# EAGLE design Dendro (EAGLE 9.6.2)
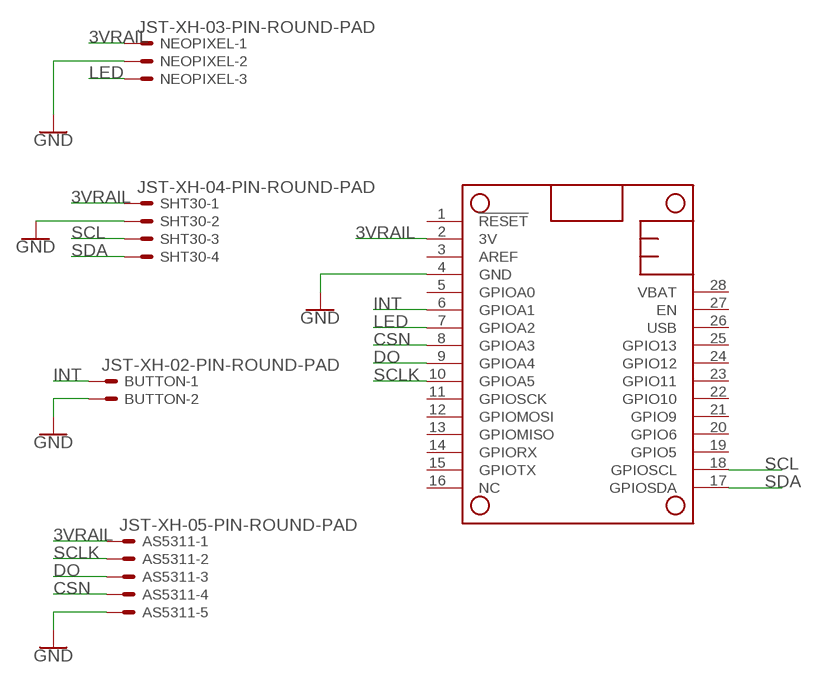
[diagram p0: schematic, sheet 1]

## Parts
AS5311  JST-XH-05-PIN-ROUND-PAD  [JST-XH-05-PACKAGE-ROUND-PAD]
BUTTON  JST-XH-02-PIN-ROUND-PAD  [JST-XH-02-PACKAGE-ROUND-PAD]
MS1  FEATHERWING  [FEATHERWING]
NEOPIXEL  JST-XH-03-PIN-ROUND-PAD  [JST-XH-03-PACKAGE-ROUND-PAD]
SHT30  JST-XH-04-PIN-ROUND-PAD  [JST-XH-04-PACKAGE-ROUND-PAD]

## Nets
3VRAIL: AS5311.1 MS1.2(3V) NEOPIXEL.1 SHT30.1
CSN: AS5311.4 MS1.8(GPIOA3)
DO: AS5311.3 MS1.9(GPIOA4)
GND: AS5311.5 BUTTON.2 MS1.4(GND) NEOPIXEL.2 SHT30.2
INT: BUTTON.1 MS1.6(GPIOA1)
LED: MS1.7(GPIOA2) NEOPIXEL.3
SCL: MS1.18(GPIOSCL) SHT30.3
SCLK: AS5311.2 MS1.10(GPIOA5)
SDA: MS1.17(GPIOSDA) SHT30.4
Unconnected: MS1.1(!RESET) MS1.3(AREF) MS1.5(GPIOA0) MS1.11(GPIOSCK) MS1.12(GPIOMOSI) MS1.13(GPIOMISO) MS1.14(GPIORX) MS1.15(GPIOTX) MS1.16(NC) MS1.19(GPIO5) MS1.20(GPIO6) MS1.21(GPIO9) MS1.22(GPIO10) MS1.23(GPIO11) MS1.24(GPIO12) MS1.25(GPIO13) MS1.26(USB) MS1.27(EN) MS1.28(VBAT)

## Library data of the parts
AS5311 = Rembrandt Electronics - JST XH Connectors v1-0:JST-XH-05-PIN: JST XH Connector 2 Pin Wire to board connector. Pitch: 2,54 mm, (0.100") Number of pins: 5 Created by Rembrandt Electronics www.rembrandtelectronics.com
BUTTON = Rembrandt Electronics - JST XH Connectors v1-0:JST-XH-02-PIN: JST XH Connector 2 Pin Wire to board connector. Pitch: 2,54 mm, (0.100") Number of pins: 2 Created by Rembrandt Electronics www.rembrandtelectronics.com
MS1 = modifiedAdafruit:FEATHERWING
NEOPIXEL = Rembrandt Electronics - JST XH Connectors v1-0:JST-XH-03-PIN: JST XH Connector 2 Pin Wire to board connector. Pitch: 2,54 mm, (0.100") Number of pins: 3 Created by Rembrandt Electronics www.rembrandtelectronics.com
SHT30 = Rembrandt Electronics - JST XH Connectors v1-0:JST-XH-04-PIN: JST XH Connector 2 Pin Wire to board connector. Pitch: 2,54 mm, (0.100") Number of pins: 4 Created by Rembrandt Electronics www.rembrandtelectronics.com

## Board
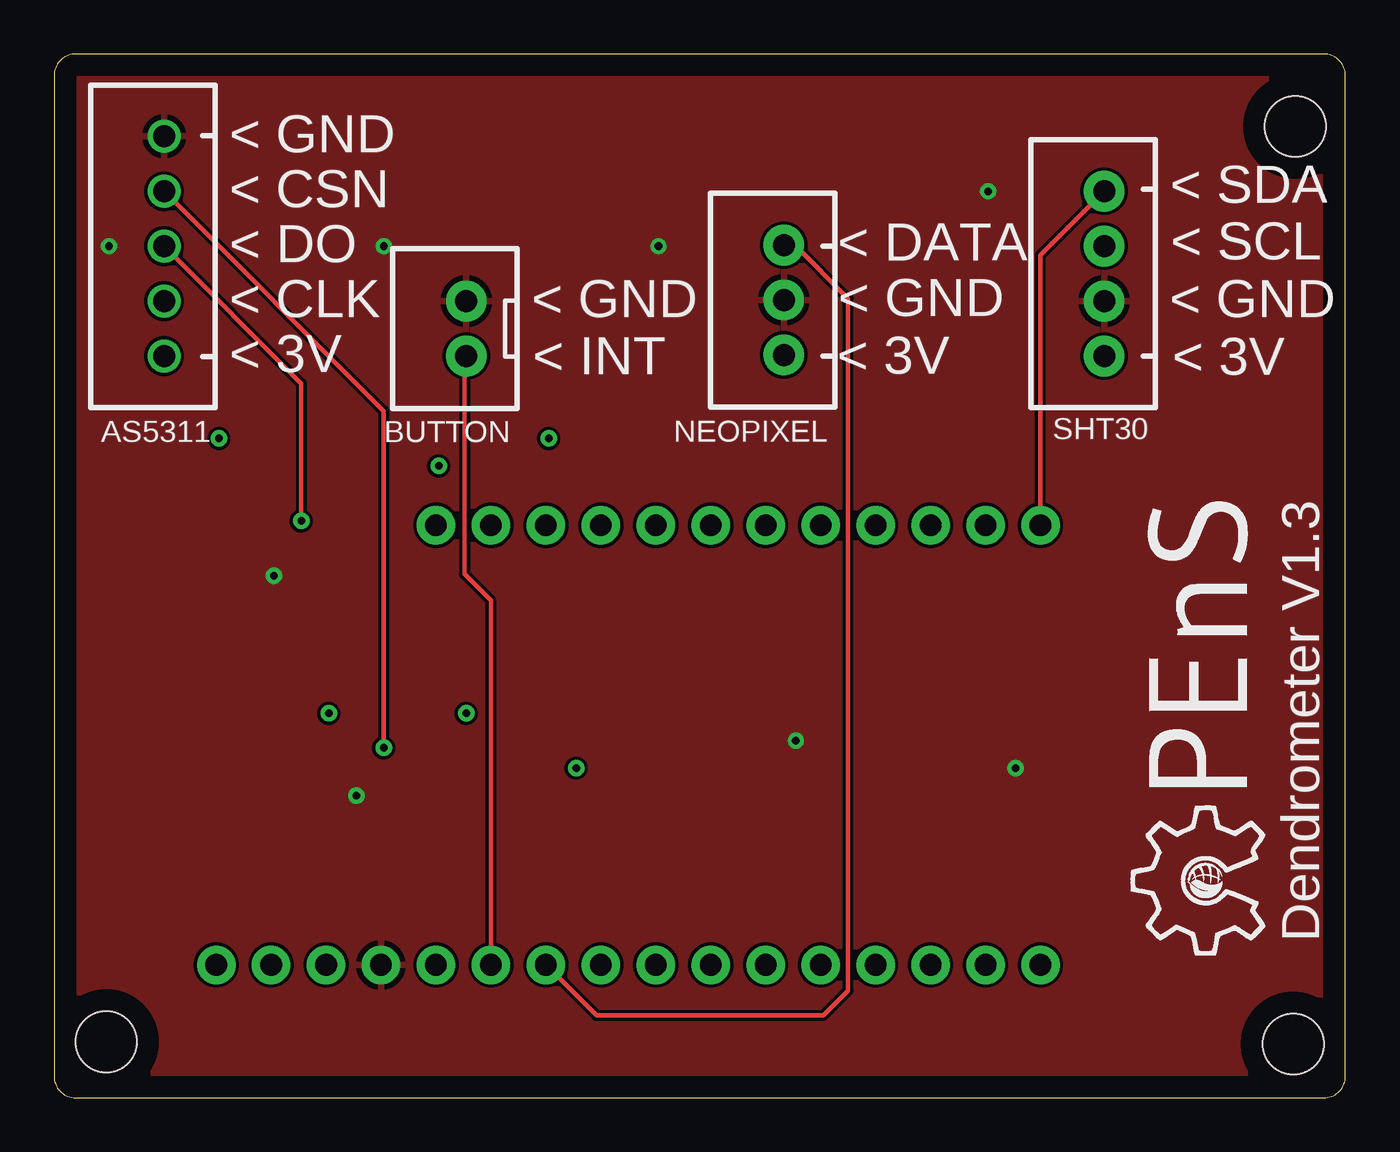
[diagram p1: board, top side]
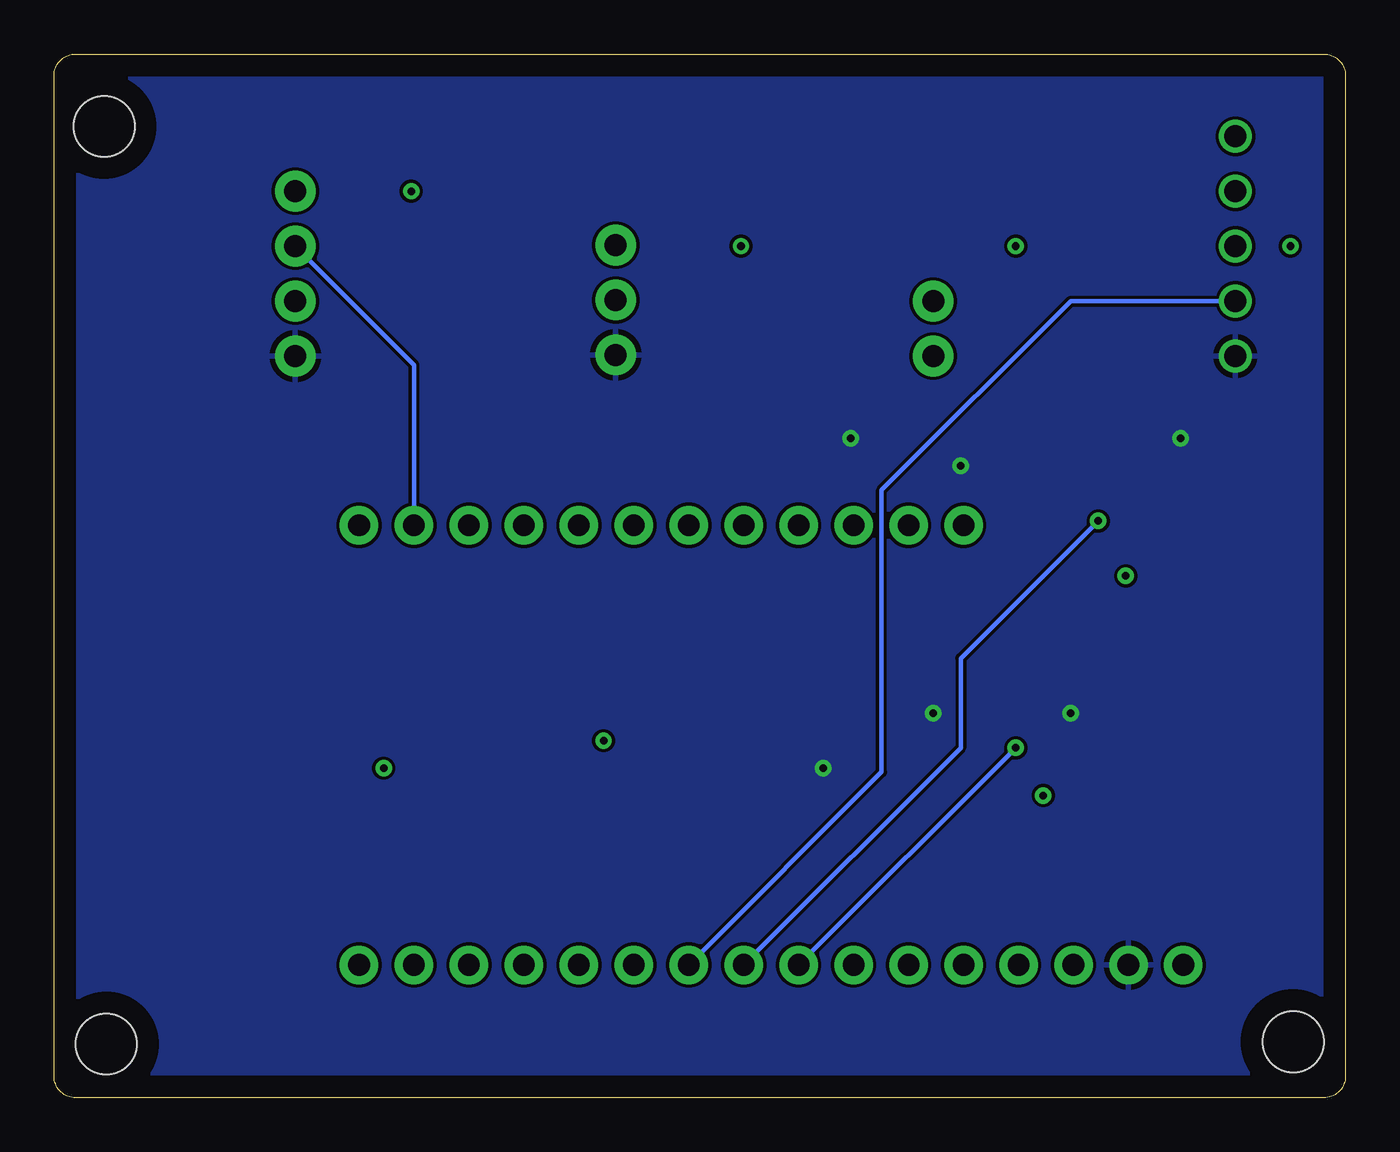
[diagram p2: board, bottom side, seen from below]

Size 59.69 x 48.25 mm. Coordinates in mm from the lower left corner, seen from the top.
Outline: 0,47.25 0,1 arc90 1,0 58.69,0 arc90 59.69,1 59.69,47.25 arc90 58.69,48.25 1,48.25 arc90 0,47.25
Copper layers (1*16): Top 0.035mm / dielectric 1.5mm / Bottom 0.035mm
Design rules "default": minimum track width 6mil, minimum drill 0.35mm, track to track 6mil, track to pad 6mil, pad to pad 6mil, via to via 6mil, smd to smd 6mil, copper to edge 40mil, drill to drill 6mil, minimum pad ring 10mil, minimum via ring 8mil, stop-mask expansion 4mil, vias tented up to drill 0mil, thermal gap 10mil
Holes 2.8 mm at 2.41,2.59 57.38,44.91 57.28,2.49

### Footprints (pad centres in the part's own frame; a part is rotated, then mirrored left to right if it is on the bottom)
JST-XH-05-PACKAGE-ROUND-PAD = drill 1.016: 1 -5.08,0; 2 -2.54,0; 3 0,0; 4 2.54,0; 5 5.08,0
JST-XH-02-PACKAGE-ROUND-PAD = drill 1.016 pad 1.88: 1 -1.27,0; 2 1.27,0
FEATHERWING = drill 1 pad 1.778: 1 6.35,1.27; 2 8.89,1.27; 3 11.43,1.27; 4 13.97,1.27; 5 16.51,1.27; 6 19.05,1.27; 7 21.59,1.27; 8 24.13,1.27; 9 26.67,1.27; 10 29.21,1.27; 11 31.75,1.27; 12 34.29,1.27; 13 36.83,1.27; 14 39.37,1.27; 15 41.91,1.27; 16 44.45,1.27; 17 44.45,21.59; 18 41.91,21.59; 19 39.37,21.59; 20 36.83,21.59; 21 34.29,21.59; 22 31.75,21.59; 23 29.21,21.59; 24 26.67,21.59; 25 24.13,21.59; 26 21.59,21.59; 27 19.05,21.59; 28 16.51,21.59
JST-XH-03-PACKAGE-ROUND-PAD = drill 1.016 pad 1.88: 1 -2.54,0; 2 0,0; 3 2.54,0
JST-XH-04-PACKAGE-ROUND-PAD = drill 1.016 pad 1.88: 1 -3.81,0; 2 -1.27,0; 3 1.27,0; 4 3.81,0

### Placement (x,y rotation side)
AS5311  5.08,39.37 90 top
BUTTON  19.05,35.56 90 top
MS1  1.14,4.88 0 top
NEOPIXEL  33.73,36.88 90 top
SHT30  48.54,38.1 90 top
U$1  [OPENS-LOGO]  59.69,6.35 90 top

### Tracks (layer width: path | path; a pad name or v marks a point on that pad's centre or on a via)
3VRAIL  (via drill 0.35)
  other vias: 17.78,29.21 22.86,30.48 12.7,17.78 19.05,17.78 24.13,15.24 7.62,30.48
  pour Bottom: 0,0 0,48.26 59.69,48.26 59.69,0
CSN  (via drill 0.35)
  Top 0.203: AS5311.4 15.24,31.75 v15.24,16.18
  Bottom 0.203: MS1.8 v15.24,16.18
DO  (via drill 0.35)
  Top 0.203: AS5311.3 11.43,33.02 v11.43,26.67
  Bottom 0.203: v11.43,26.67 17.78,20.32 17.78,16.18 MS1.9
GND  (via drill 0.35)
  other vias: 10.16,24.13 15.24,39.37 13.97,13.97 2.54,39.37 43.18,41.91 27.94,39.37 44.45,15.24 34.29,16.51
  pour Top: 0,0 0,48.26 59.69,48.26 59.69,0
INT
  Top 0.203: MS1.6 20.19,22.99 18.97,24.21 18.97,34.21 BUTTON.1
LED
  Top 0.203: MS1.7 25.07,3.81 35.56,3.81 36.7,4.95 36.7,36.96 34.24,39.42 NEOPIXEL.3
SCL
  Bottom 0.203: MS1.18 43.05,33.88 SHT30.3
SCLK
  Bottom 0.203: MS1.10 21.44,15.06 21.44,28.09 12.7,36.83 AS5311.2
SDA
  Top 0.203: MS1.17 45.59,38.96 SHT30.4

### Text on the board
tPlace: Dendrometer V1.3
tNames: < GND | < CSN | < SDA | < DO | < DATA | < SCL | < CLK | < GND | < GND | < GND | < 3V | < INT | < 3V | < 3V